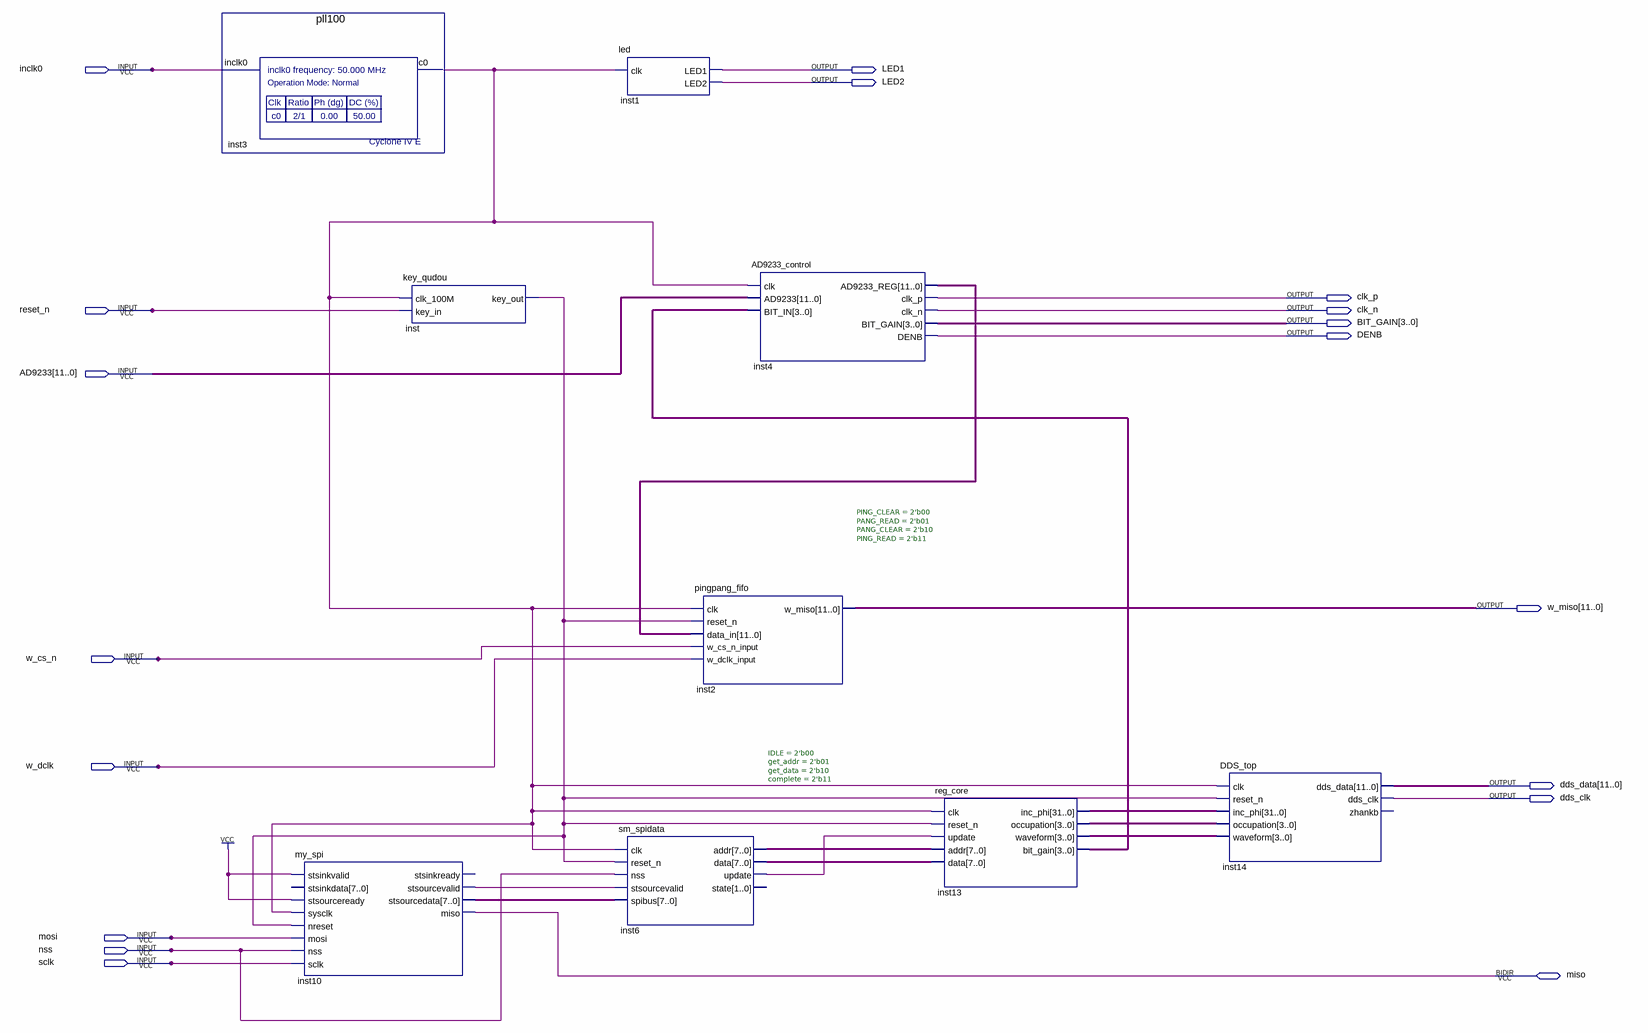
[diagram p0: schematic sheet]
// Quartus schematic E18_1_MONIKA.bdf as structural Verilog: 9 symbols, 18 pins
module E18_1_MONIKA (
  input  inclk0,
  input  reset_n,
  input  [11:0] AD9233,
  input  w_cs_n,
  input  w_dclk,
  input  mosi,
  input  nss,
  input  sclk,
  inout  miso,
  output LED1,
  output LED2,
  output clk_p,
  output clk_n,
  output [3:0] BIT_GAIN,
  output DENB,
  output [11:0] w_miso,
  output [11:0] dds_data,
  output dds_clk
);

  wire inst3_c0, inst6_update, inst10_stsourcevalid, inst_key_out;
  wire [3:0] inst13_bit_gain, inst13_occupation, inst13_waveform;
  wire [7:0] inst6_addr, inst6_data, inst10_stsourcedata;
  wire [11:0] inst4_ad9233_reg;
  wire [31:0] inst13_inc_phi;

  pll100 inst3 (.inclk0(inclk0), .c0(inst3_c0));
  my_spi inst10 (
    .stsinkvalid(1'b1), .stsourceready(1'b1), .sysclk(inst3_c0), .nreset(inst_key_out), .mosi(mosi),
    .nss(nss), .sclk(sclk), .stsourcevalid(inst10_stsourcevalid), .stsourcedata(inst10_stsourcedata),
    .miso(miso));  // open: stsinkdata, stsinkready
  key_qudou inst (.clk_100M(inst3_c0), .key_in(reset_n), .key_out(inst_key_out));
  led inst1 (.clk(inst3_c0), .LED1(LED1), .LED2(LED2));
  sm_spidata #(.IDLE(2'b00), .get_addr(2'b01), .get_data(2'b10), .complete(2'b11)) inst6 (
    .clk(inst3_c0), .reset_n(inst_key_out), .nss(nss), .stsourcevalid(inst10_stsourcevalid),
    .spibus(inst10_stsourcedata), .addr(inst6_addr), .data(inst6_data), .update(inst6_update));  // open: state
  pingpang_fifo #(.PING_CLEAR(2'b00), .PANG_READ(2'b01), .PANG_CLEAR(2'b10), .PING_READ(2'b11)) inst2 (
    .clk(inst3_c0), .reset_n(inst_key_out), .data_in(inst4_ad9233_reg), .w_cs_n_input(w_cs_n),
    .w_dclk_input(w_dclk), .w_miso(w_miso));
  AD9233_control inst4 (
    .clk(inst3_c0), .AD9233(AD9233), .BIT_IN(inst13_bit_gain), .AD9233_REG(inst4_ad9233_reg), .clk_p(clk_p),
    .clk_n(clk_n), .BIT_GAIN(BIT_GAIN), .DENB(DENB));
  reg_core inst13 (
    .clk(inst3_c0), .reset_n(inst_key_out), .update(inst6_update), .addr(inst6_addr), .data(inst6_data),
    .inc_phi(inst13_inc_phi), .occupation(inst13_occupation), .waveform(inst13_waveform),
    .bit_gain(inst13_bit_gain));
  DDS_top inst14 (
    .clk(inst3_c0), .reset_n(inst_key_out), .inc_phi(inst13_inc_phi), .occupation(inst13_occupation),
    .waveform(inst13_waveform), .dds_data(dds_data), .dds_clk(dds_clk));  // open: zhankb
endmodule
